# EAGLE design helen-art (EAGLE 7.7.0)
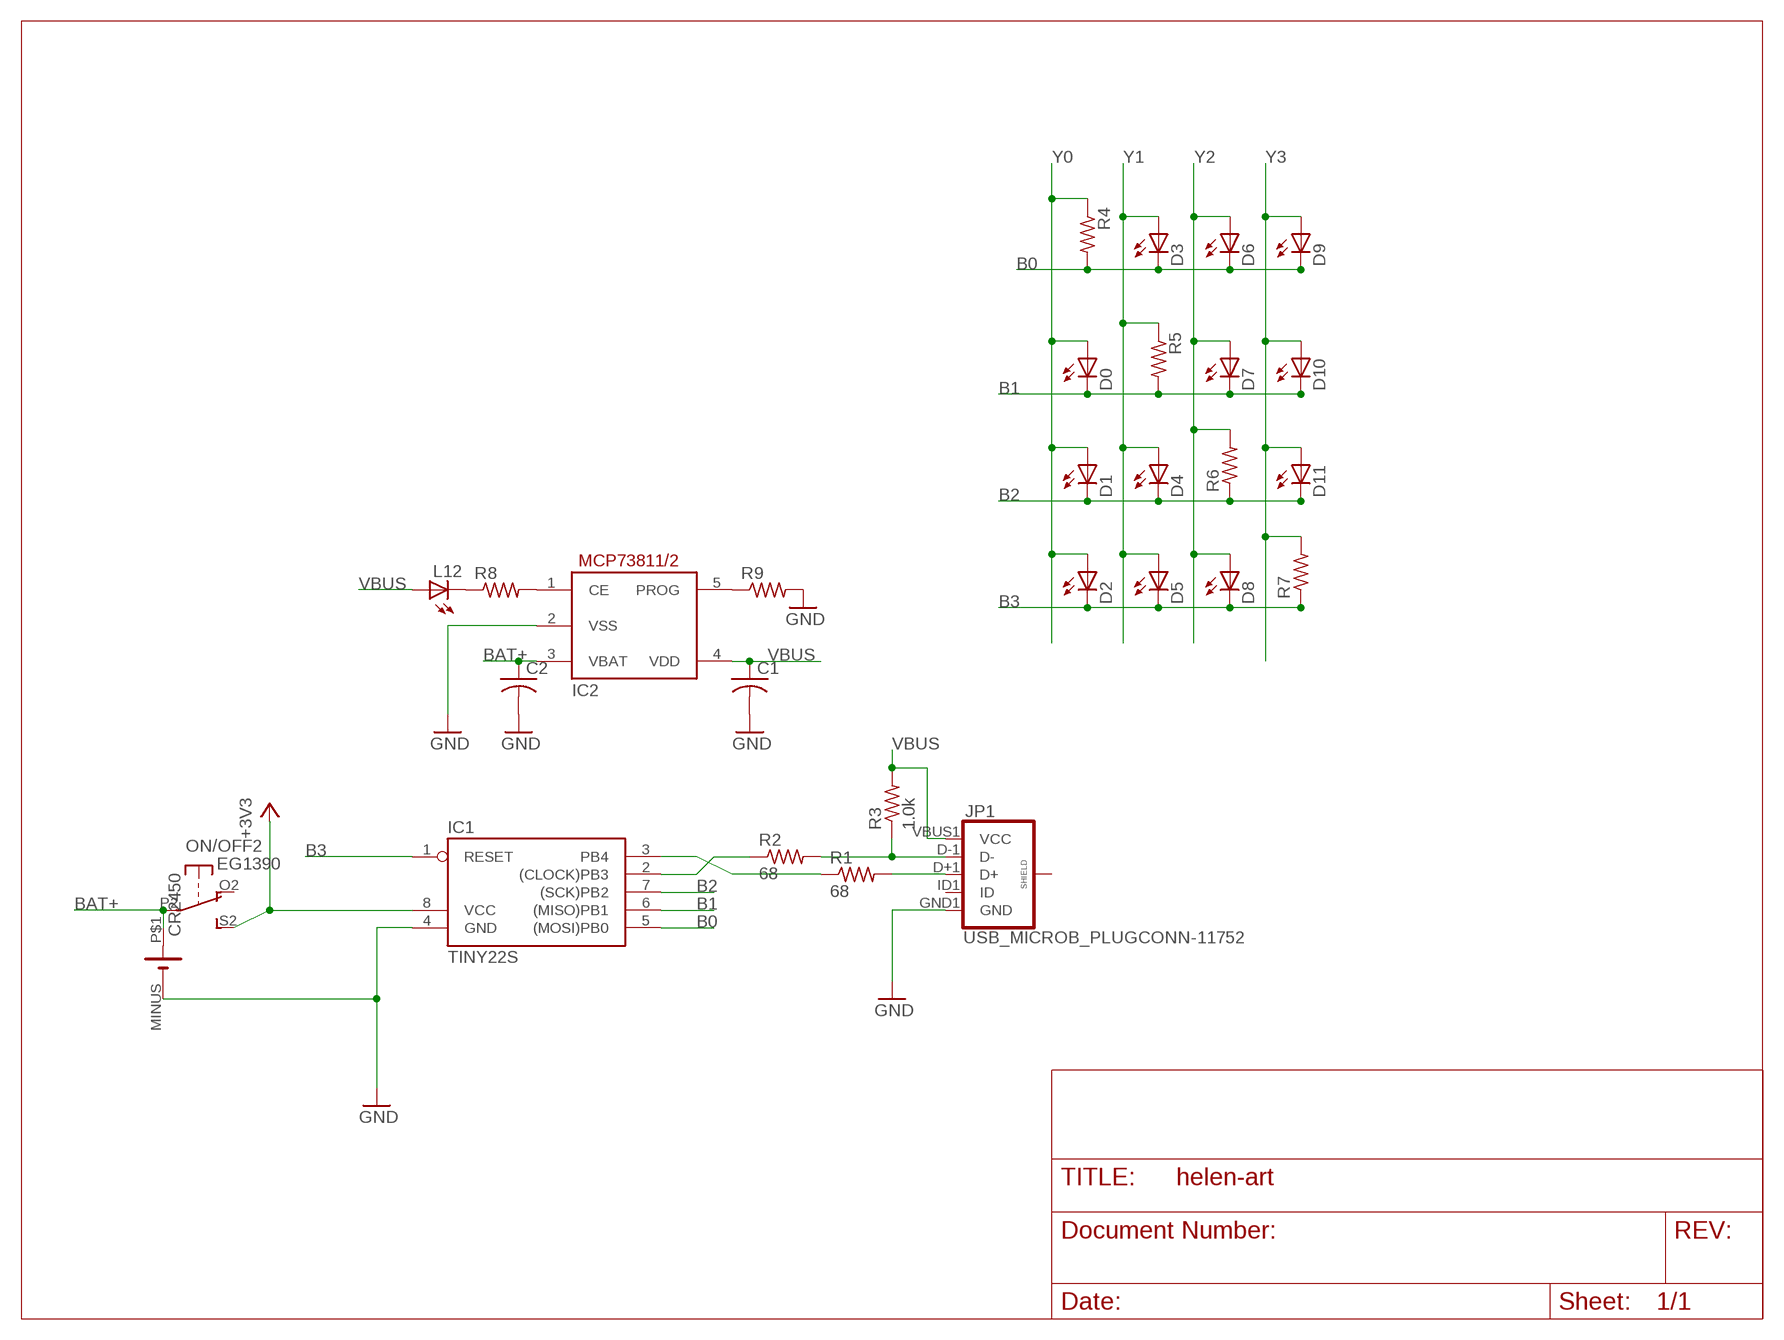
[diagram p0: schematic, sheet 1]

## Parts
C1  C-USC0603  [C0603]
C2  C-USC0603  [C0603]
D0  LEDCHIPLED_0805  [CHIPLED_0805]
D1  LEDCHIPLED_0805  [CHIPLED_0805]
D2  LEDCHIPLED_0805  [CHIPLED_0805]
D3  LEDCHIPLED_0805  [CHIPLED_0805]
D4  LEDCHIPLED_0805  [CHIPLED_0805]
D5  LEDCHIPLED_0805  [CHIPLED_0805]
D6  LEDCHIPLED_0805  [CHIPLED_0805]
D7  LEDCHIPLED_0805  [CHIPLED_0805]
D8  LEDCHIPLED_0805  [CHIPLED_0805]
D9  LEDCHIPLED_0805  [CHIPLED_0805]
D10  LEDCHIPLED_0805  [CHIPLED_0805]
D11  LEDCHIPLED_0805  [CHIPLED_0805]
IC1  TINY22S  [SOIC8]
IC2  MCP73811/2  [SOT23-5L]
JP1  USB_MICROB_PLUGCONN-11752  [USB-B-MICRO-SMD_V03]
L12  LEDCHIPLED_0805  [CHIPLED_0805]
ON/OFF  EG1390  DPDT-EG1390  [EG1390]
R1  68  R-US_R0603  [R0603]
R2  68  R-US_R0603  [R0603]
R3  1.0k  R-US_R0603  [R0603]
R4  R-US_R0603  [R0603]
R5  R-US_R0603  [R0603]
R6  R-US_R0603  [R0603]
R7  R-US_R0603  [R0603]
R8  R-US_R0603  [R0603]
R9  R-US_R0603  [R0603]
U$3  CR2450  CR2450_KEYSTONE  [CR2450_KEYSTONE]

## Nets
+3V3: IC1.8(VCC) ON/OFF.S2(2:S)
B0: D3.C D6.C D9.C IC1.5((MOSI)PB0) R4.2
B1: D0.C D7.C D10.C IC1.6((MISO)PB1) R5.2
B2: D1.C D4.C D11.C IC1.7((SCK)PB2) R6.1
B3: D2.C D5.C D8.C IC1.1(RESET) R7.1
BAT+: C2.1 IC2.3(VBAT) ON/OFF.P2(2:P) U$3.P$1(+)
GND: C1.2 C2.2 IC1.4(GND) IC2.2(VSS) JP1.GND1(GND) R9.2 U$3.MINUS(-)
N$1: JP1.D+1(D+) R1.2
N$2: JP1.D-1(D-) R2.2 R3.1
N$3: IC1.3(PB4) R1.1
N$4: IC1.2((CLOCK)PB3) R2.1
N$5: IC2.5(PROG) R9.1
N$6: IC2.1(CE) R8.2
N$7: L12.C R8.1
VBUS: C1.1 IC2.4(VDD) JP1.VBUS1(VCC) L12.A R3.2
Y0: D0.A D1.A D2.A R4.1
Y1: D3.A D4.A D5.A R5.1
Y2: D6.A D7.A D8.A R6.2
Y3: D9.A D10.A D11.A R7.2
Unconnected: JP1.ID1(ID) JP1.SHIELD1(SHIELD) JP1.SHIELD2(SHIELD) JP1.SHIELD3(SHIELD) ON/OFF.O1(1:O) ON/OFF.O2(2:O) ON/OFF.P1(1:P) ON/OFF.S1(1:S)

## Library data of the parts
C1 C2 = adafruit:C-US: CAPACITOR, American symbol
D0 D1-D11 L12 = led:LED: LED OSRAM: - CHIPLED LG R971, LG N971, LY N971, LG Q971, LY Q971, LO R971, LY R971 LH N974, LH R974 LS Q976, LO Q976, LY Q976 LO Q996 - Hyper CHIPLED LW Q18S LB Q993, LB Q99A, LB R99A - SideLED LS A670, LO A670, LY A670, LG A670, LP A670 LB A673, LV A673, LT A673, LW A673 LH A674 LY A675 LS A676, LA A676, LO A676, LY A676, LW A676 LS A679, LY A679, LG A679 - Hyper Micro SIDELED® LS Y876, LA Y876, LO Y876, LY Y876 LT Y87S - SmartLED LW L88C, LW L88S LB L89C, LB L89S, LG L890 LS L89K, LO L89K, LY L89K LS L896, LA L896, LO L896, LY L896 - TOPLED LS T670, LO T670, LY T670, LG T670, LP T670 LSG T670, LSP T670, LSY T670, LOP T670, LYG T670 LG T671, LOG T671, LSG T671 LB T673, LV T673, LT T673, LW T673 LH T674 LS T676, LA T676, LO T676, LY T676, LB T676, LH T676, LSB T676, LW T676 LB T67C, LV T67C, LT T67C, LS T67K, LO T67K, LY T67K, LW E67C LS E67B, LA E67B, LO E67B, LY E67B, LB E67C, LV E67C, LT E67C LW T67C LS T679, LY T679, LG T679 LS T770, LO T770, LY T770, LG T770, LP T770 LB T773, LV T773, LT T773, LW T773 LH T774 LS E675, LA E675, LY E675, LS T675 LS T776, LA T776, LO T776, LY T776, LB T776 LHGB T686 LT T68C, LB T68C - Hyper Mini TOPLED® LB M676 - Mini TOPLED Santana® LG M470 LS M47K, LO M47K, LY M47K Source: http://www.osram.convergy.de LUXEON: - LUMILED® LXK2-PW12-R00, LXK2-PW12-S00, LXK2-PW14-U00, LXK2-PW14-V00 LXK2-PM12-R00, LXK2-PM12-S00, LXK2-PM14-U00 LXK2-PE12-Q00, LXK2-PE12-R00, LXK2-PE12-S00, LXK2-PE14-T00, LXK2-PE14-U00 LXK2-PB12-K00, LXK2-PB12-L00, LXK2-PB12-M00, LXK2-PB14-N00, LXK2-PB14-P00, LXK2-PB14-Q00 LXK2-PR12-L00, LXK2-PR12-M00, LXK2-PR14-Q00, LXK2-PR14-R00 LXK2-PD12-Q00, LXK2-PD12-R00, LXK2-PD12-S00 LXK2-PH12-R00, LXK2-PH12-S00 LXK2-PL12-P00, LXK2-PL12-Q00, LXK2-PL12-R00 Source: www.luxeon.com KINGBRIGHT: KA-3528ASYC Source: www.kingbright.com
IC1 = atmel:TINY22: MICROCONTROLLER 1K ROM 128 bytes RAM 128 bytes EEPROM; OC_FARNELL: unknown; OC_NEWARK: unknown
IC2 = adafruit:MCP73811/2: MCP73811 and MCP73812 Simple, Miniature Single-Cell, Fully Integrated Li-Ion / Li-Polymer Charge Management Controllers SOT-23-5 package, no indicator LED but with adjustable current, small and very inexpensive
JP1 = SparkFun-Connectors:USB_MICROB_PLUG: USB Micro-B connectors Some male, some female. Watch your step!; PROD_ID: CONN-11752
ON/OFF = adafruit:DPDT
R1-R9 = resistor:R-US_: RESISTOR, American symbol
U$3 = _custom:CR2450_KEYSTONE

## Board
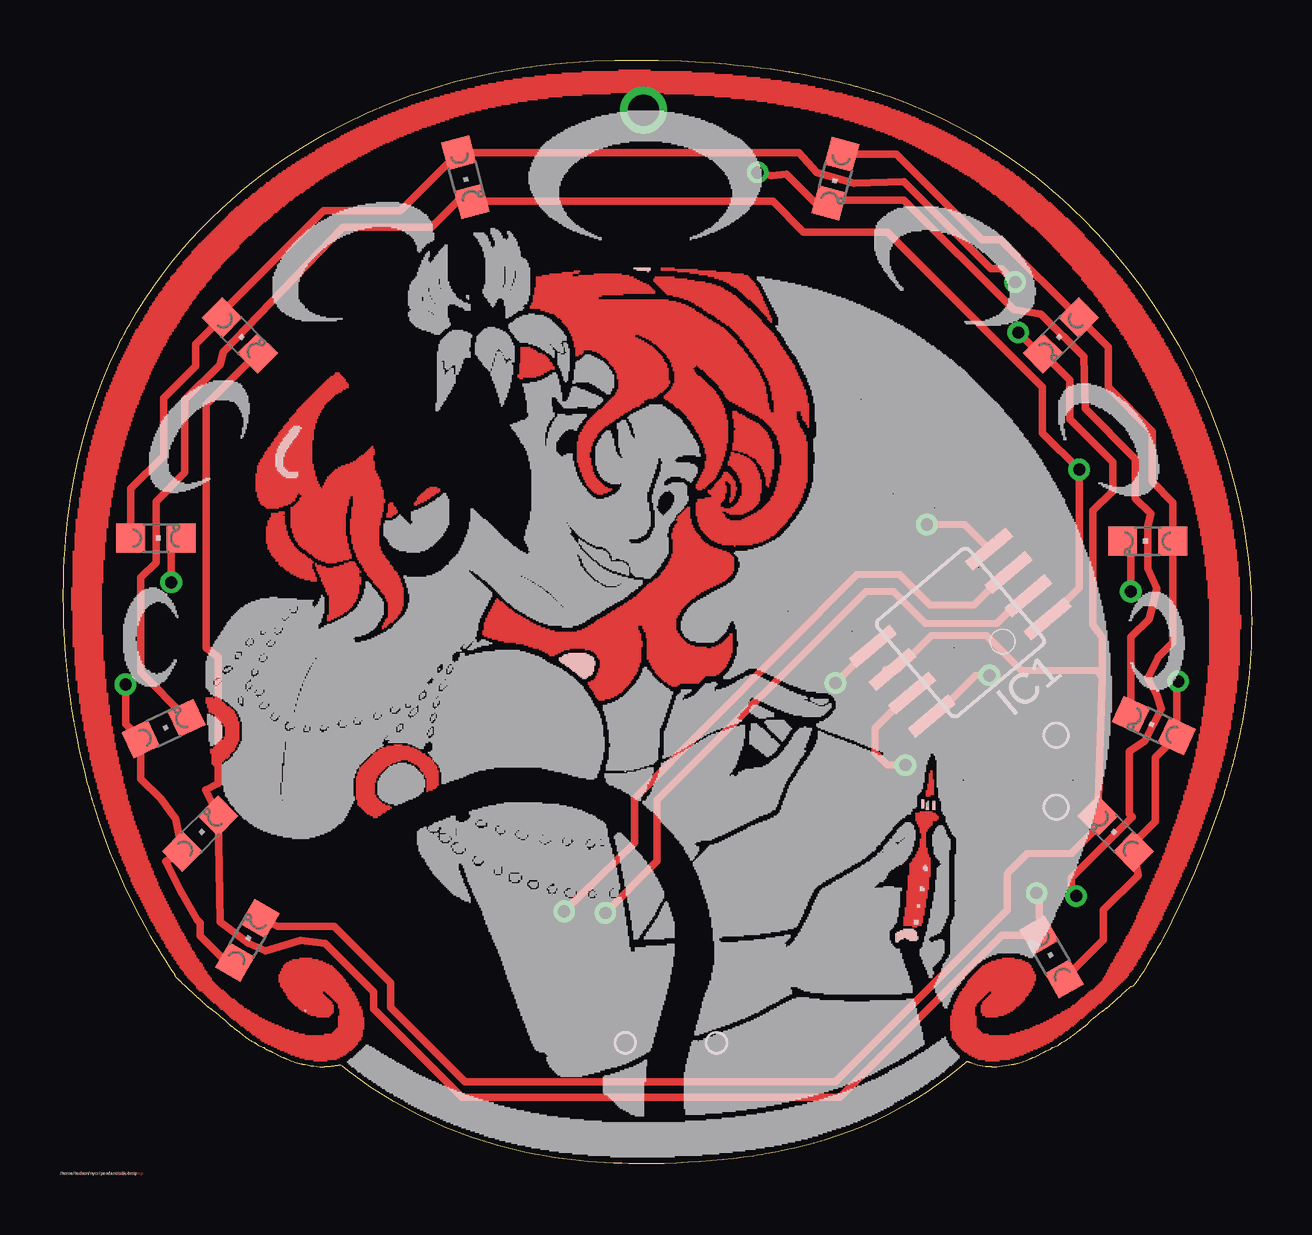
[diagram p1: board, top side]
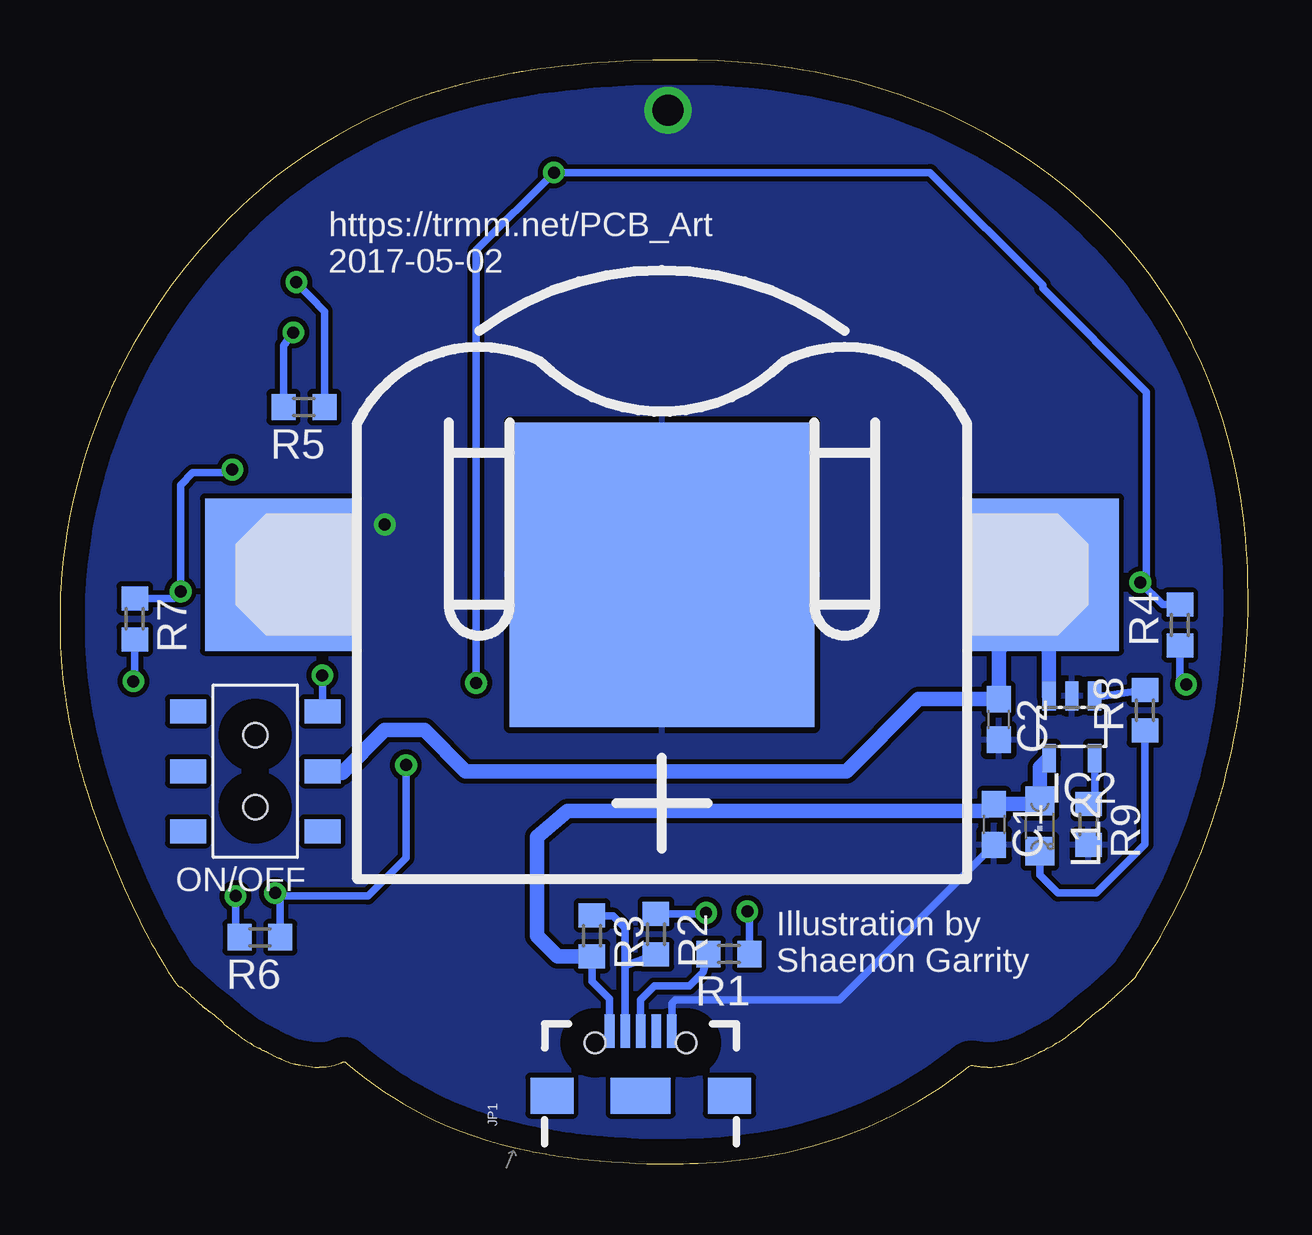
[diagram p2: board, bottom side, seen from below]

Size 49.53 x 46.02 mm. Coordinates in mm from the lower left corner, seen from the top.
Outline: 23.29,0.02 23.56,0.01 23.8,0 24.01,0 24.2,0 24.39,0 24.59,0 24.81,0.01 25.05,0.01 25.55,0.03 26.04,0.06 26.54,0.09 27.02,0.13 27.49,0.17 27.94,0.22 28.36,0.27 28.74,0.33 28.94,0.36 29.11,0.39 29.27,0.41 29.41,0.44 29.54,0.46 29.67,0.49 29.81,0.51 29.96,0.54 30.56,0.67 31.15,0.82 31.72,0.98 32.27,1.16 32.81,1.36 33.34,1.57 33.86,1.8 34.37,2.05 34.79,2.28 35.2,2.51 35.61,2.76 36.01,3.01 36.39,3.27 36.77,3.54 37.12,3.82 37.46,4.09 37.5,4.12 37.53,4.15 37.56,4.18 37.59,4.2 37.62,4.22 37.64,4.24 37.65,4.25 37.66,4.26 37.67,4.26 37.68,4.26 37.69,4.25 37.72,4.25 37.74,4.24 37.77,4.23 37.79,4.22 37.82,4.2 37.9,4.17 37.99,4.14 38.09,4.11 38.2,4.09 38.31,4.07 38.43,4.06 38.55,4.04 38.66,4.04 38.69,4.04 38.71,4.04 38.73,4.04 38.75,4.03 38.76,4.03 38.78,4.03 38.79,4.03 38.79,4.03 38.83,4.02 38.91,4.03 39.02,4.04 39.14,4.06 39.28,4.08 39.4,4.1 39.52,4.12 39.6,4.14 39.61,4.14 39.63,4.15 39.65,4.15 39.66,4.15 39.68,4.16 39.69,4.16 39.7,4.16 39.7,4.16 39.73,4.16 39.78,4.17 39.85,4.19 39.92,4.22 40.01,4.25 40.09,4.28 40.18,4.32 40.26,4.36 40.28,4.37 40.3,4.38 40.32,4.38 40.34,4.39 40.36,4.4 40.38,4.41 40.39,4.41 40.4,4.42 40.44,4.43 40.49,4.45 40.55,4.48 40.62,4.51 40.68,4.55 40.75,4.58 40.81,4.61 40.85,4.64 40.87,4.65 40.89,4.66 40.9,4.67 40.92,4.68 40.93,4.69 40.95,4.69 40.95,4.69 40.96,4.7 40.98,4.7 41.01,4.71 41.05,4.73 41.08,4.74 41.12,4.76 41.14,4.78 41.17,4.79 41.18,4.81 41.18,4.81 41.18,4.82 41.19,4.82 41.2,4.83 41.2,4.83 41.21,4.83 41.22,4.83 41.23,4.83 41.26,4.84 41.3,4.85 41.35,4.88 41.4,4.9 41.45,4.93 41.49,4.96 41.52,4.98 41.53,4.99 41.53,5 41.54,5 41.55,5.01 41.56,5.01 41.57,5.02 41.58,5.03 41.6,5.04 41.61,5.05 41.66,5.07 41.71,5.1 41.76,5.12 41.81,5.15 41.86,5.18 41.9,5.21 41.93,5.23 41.94,5.24 41.96,5.26 42,5.3 42.06,5.35 42.13,5.4 42.2,5.45 42.26,5.5 42.3,5.53 42.33,5.55 42.34,5.55 42.34,5.56 42.35,5.56 42.37,5.57 42.38,5.58 42.39,5.59 42.4,5.6 42.42,5.61 42.46,5.64 42.49,5.67 42.52,5.69 42.54,5.71 42.55,5.72 42.56,5.72 42.57,5.73 42.57,5.73 42.58,5.73 42.58,5.73 42.59,5.74 42.61,5.75 42.62,5.77 42.64,5.78 42.66,5.8 42.68,5.82 42.75,5.89 42.84,5.97 42.93,6.06 43.02,6.14 43.11,6.21 43.19,6.27 43.24,6.32 43.28,6.35 43.29,6.35 43.31,6.36 43.32,6.37 43.33,6.38 43.35,6.39 43.36,6.4 43.37,6.41 43.38,6.42 43.39,6.43 43.4,6.44 43.42,6.45 43.43,6.46 43.45,6.47 43.46,6.48 43.47,6.48 43.49,6.49 43.5,6.5 43.51,6.51 43.53,6.52 43.54,6.53 43.56,6.54 43.57,6.55 43.58,6.56 43.59,6.58 43.61,6.59 43.62,6.61 43.64,6.63 43.67,6.65 43.69,6.67 43.72,6.7 43.75,6.72 43.78,6.75 43.81,6.77 43.84,6.8 43.87,6.83 43.91,6.86 43.94,6.89 43.97,6.92 44,6.95 44.03,6.97 44.15,7.09 44.25,7.18 44.33,7.25 44.39,7.3 44.43,7.34 44.46,7.36 44.48,7.38 44.49,7.38 44.53,7.38 44.58,7.4 44.62,7.45 44.69,7.52 44.77,7.64 44.87,7.8 45.01,8.01 45.18,8.29 45.34,8.55 45.47,8.78 45.6,8.99 45.72,9.2 45.83,9.41 45.95,9.63 46.07,9.87 46.2,10.14 46.52,10.78 46.83,11.45 47.13,12.14 47.42,12.84 47.7,13.53 47.95,14.2 48.18,14.85 48.38,15.45 48.4,15.51 48.42,15.57 48.43,15.62 48.45,15.68 48.46,15.72 48.48,15.76 48.48,15.78 48.49,15.8 48.5,15.84 48.52,15.89 48.54,15.95 48.56,16.02 48.58,16.1 48.6,16.19 48.63,16.28 48.65,16.37 48.66,16.41 48.67,16.44 48.68,16.48 48.69,16.52 48.7,16.55 48.71,16.57 48.72,16.59 48.72,16.61 48.73,16.62 48.73,16.65 48.74,16.69 48.76,16.74 48.77,16.79 48.79,16.85 48.8,16.92 48.82,16.99 48.83,17.06 48.85,17.13 48.87,17.21 48.89,17.29 48.91,17.36 48.93,17.43 48.94,17.5 48.95,17.55 48.99,17.72 49.04,17.92 49.08,18.15 49.13,18.4 49.18,18.66 49.22,18.91 49.26,19.15 49.29,19.36 49.33,19.6 49.36,19.82 49.38,20.03 49.41,20.24 49.43,20.47 49.45,20.71 49.48,20.99 49.5,21.32 49.51,21.53 49.52,21.84 49.53,22.22 49.53,22.63 49.52,23.04 49.52,23.43 49.51,23.76 49.5,23.99 49.45,24.62 49.39,25.23 49.31,25.83 49.22,26.42 49.11,27 48.99,27.59 48.85,28.19 48.69,28.8 48.58,29.19 48.45,29.61 48.3,30.05 48.14,30.5 47.98,30.94 47.81,31.37 47.64,31.78 47.48,32.14 47.46,32.2 47.43,32.26 47.39,32.33 47.36,32.4 47.33,32.47 47.3,32.53 47.28,32.59 47.25,32.64 47.23,32.69 47.2,32.76 47.16,32.84 47.12,32.92 47.07,33.01 47.03,33.11 46.98,33.2 46.93,33.29 46.47,34.15 45.98,34.99 45.46,35.8 44.91,36.58 44.33,37.34 43.72,38.08 43.09,38.78 42.42,39.47 42.17,39.72 41.93,39.94 41.7,40.16 41.48,40.36 41.25,40.56 41.02,40.75 40.77,40.95 40.51,41.16 39.92,41.61 39.29,42.05 38.65,42.47 37.98,42.87 37.31,43.24 36.62,43.59 35.93,43.91 35.24,44.19 35.09,44.25 34.93,44.31 34.76,44.37 34.59,44.44 34.42,44.49 34.27,44.55 34.14,44.59 34.05,44.62 34.02,44.63 33.98,44.64 33.94,44.66 33.89,44.67 33.83,44.69 33.78,44.71 33.73,44.72 33.67,44.74 33.62,44.76 33.55,44.78 33.48,44.8 33.41,44.82 33.33,44.84 33.26,44.86 33.19,44.88 33.13,44.9 33.07,44.91 33.01,44.93 32.95,44.95 32.89,44.96 32.84,44.98 32.8,44.99 32.76,45 32.74,45 32.56,45.05 32.33,45.11 32.05,45.17 31.75,45.24 31.44,45.3 31.14,45.36 30.86,45.42 30.63,45.46 30.58,45.47 30.52,45.48 30.47,45.49 30.41,45.5 30.36,45.51 30.31,45.52 30.27,45.52 30.23,45.53 29.89,45.59 29.49,45.64 29.06,45.7 28.59,45.75 28.1,45.8 27.61,45.85 27.12,45.89 26.65,45.93 25.74,45.98 24.81,46.01 23.89,46.02 22.98,46 22.1,45.97 21.26,45.93 20.46,45.86 19.73,45.77 19.5,45.74 19.32,45.71 19.16,45.69 19.02,45.67 18.91,45.65 18.79,45.64 18.68,45.62 18.56,45.6 18.29,45.55 18.01,45.5 17.74,45.44 17.46,45.39 17.18,45.32 16.9,45.26 16.62,45.19 16.35,45.12 15.4,44.85 14.47,44.54 13.55,44.19 12.65,43.81 11.77,43.39 10.91,42.93 10.07,42.44 9.25,41.92 8.77,41.59 8.31,41.25 7.87,40.91 7.44,40.56 7.02,40.2 6.59,39.81 6.16,39.4 5.73,38.96 5.31,38.52 4.9,38.06 4.5,37.57 4.11,37.07 3.74,36.55 3.39,36.03 3.06,35.51 2.76,34.99 2.67,34.83 2.6,34.7 2.54,34.6 2.49,34.51 2.45,34.42 2.4,34.33 2.35,34.23 2.28,34.1 1.94,33.37 1.62,32.61 1.33,31.83 1.06,31.03 0.82,30.21 0.62,29.39 0.44,28.58 0.31,27.77 0.24,27.31 0.19,26.87 0.14,26.45 0.1,26.04 0.07,25.63 0.04,25.21 0.02,24.76 0.01,24.28 0,23.69 0,23.08 0.02,22.46 0.05,21.82 0.1,21.19 0.15,20.56 0.22,19.95 0.3,19.36 0.33,19.17 0.35,19.01 0.37,18.88 0.39,18.77 0.4,18.68 0.42,18.61 0.43,18.55 0.43,18.51 0.44,18.49 0.44,18.46 0.45,18.43 0.46,18.4 0.46,18.36 0.47,18.32 0.48,18.28 0.48,18.24 0.53,17.99 0.59,17.68 0.67,17.32 0.75,16.94 0.84,16.56 0.92,16.21 1,15.91 1.07,15.68 1.07,15.65 1.08,15.63 1.09,15.6 1.1,15.57 1.11,15.53 1.12,15.5 1.13,15.47 1.14,15.43 1.14,15.4 1.15,15.37 1.16,15.34 1.17,15.31 1.18,15.28 1.18,15.26 1.19,15.24 1.19,15.23 1.2,15.22 1.21,15.2 1.21,15.17 1.22,15.14 1.23,15.11 1.24,15.08 1.25,15.04 1.26,15.01 1.47,14.34 1.7,13.67 1.96,12.99 2.24,12.31 2.54,11.64 2.85,10.98 3.17,10.34 3.51,9.73 3.64,9.49 3.79,9.24 3.95,8.98 4.11,8.73 4.26,8.49 4.39,8.28 4.5,8.11 4.59,7.99 4.6,7.98 4.61,7.96 4.62,7.94 4.63,7.92 4.64,7.9 4.65,7.88 4.66,7.86 4.67,7.84 4.68,7.82 4.69,7.8 4.7,7.79 4.71,7.77 4.72,7.75 4.74,7.74 4.75,7.73 4.76,7.72 4.77,7.71 4.78,7.7 4.8,7.68 4.81,7.67 4.83,7.66 4.85,7.64 4.86,7.63 4.87,7.61 4.9,7.59 4.92,7.56 4.96,7.53 5,7.49 5.05,7.44 5.12,7.38 5.2,7.3 5.29,7.22 5.32,7.19 5.36,7.15 5.4,7.12 5.43,7.09 5.47,7.06 5.5,7.03 5.53,7 5.56,6.97 5.58,6.95 5.61,6.92 5.65,6.89 5.68,6.86 5.71,6.83 5.75,6.8 5.78,6.77 5.81,6.75 5.84,6.72 5.86,6.7 5.89,6.67 5.92,6.65 5.94,6.63 5.96,6.61 5.98,6.59 5.99,6.58 6,6.56 6.02,6.55 6.03,6.54 6.04,6.53 6.06,6.52 6.07,6.51 6.09,6.5 6.1,6.49 6.11,6.48 6.12,6.48 6.14,6.47 6.15,6.46 6.17,6.45 6.18,6.44 6.19,6.43 6.2,6.42 6.21,6.41 6.23,6.4 6.24,6.39 6.25,6.38 6.27,6.37 6.28,6.36 6.29,6.35 6.3,6.35 6.34,6.32 6.4,6.27 6.48,6.21 6.56,6.14 6.66,6.06 6.75,5.97 6.83,5.89 6.91,5.82 6.93,5.8 6.95,5.78 6.96,5.77 6.98,5.75 6.99,5.74 7,5.73 7.01,5.73 7.01,5.73 7.02,5.73 7.02,5.72 7.03,5.72 7.05,5.71 7.07,5.69 7.09,5.67 7.13,5.64 7.17,5.61 7.18,5.6 7.19,5.59 7.21,5.58 7.22,5.57 7.23,5.56 7.24,5.56 7.25,5.55 7.26,5.55 7.28,5.53 7.33,5.5 7.39,5.45 7.46,5.4 7.52,5.35 7.58,5.3 7.62,5.26 7.65,5.24 7.66,5.23 7.69,5.21 7.73,5.18 7.77,5.15 7.83,5.12 7.88,5.1 7.93,5.07 7.97,5.05 7.99,5.04 8,5.03 8.02,5.02 8.03,5.01 8.04,5.01 8.05,5 8.05,5 8.05,4.99 8.06,4.98 8.09,4.96 8.14,4.93 8.18,4.9 8.24,4.88 8.28,4.85 8.32,4.84 8.35,4.83 8.36,4.83 8.37,4.83 8.38,4.83 8.39,4.83 8.4,4.82 8.4,4.82 8.41,4.81 8.41,4.81 8.42,4.79 8.44,4.78 8.47,4.76 8.5,4.74 8.54,4.73 8.57,4.71 8.6,4.7 8.62,4.7 8.63,4.69 8.64,4.69 8.65,4.69 8.67,4.68 8.68,4.67 8.7,4.66 8.72,4.65 8.73,4.64 8.78,4.61 8.84,4.58 8.9,4.54 8.97,4.51 9.03,4.48 9.09,4.45 9.14,4.43 9.18,4.42 9.19,4.41 9.21,4.41 9.22,4.4 9.24,4.39 9.26,4.38 9.28,4.38 9.31,4.37 9.33,4.36 9.41,4.32 9.49,4.28 9.58,4.25 9.66,4.22 9.74,4.19 9.8,4.17 9.85,4.16 9.88,4.16 9.89,4.16 9.9,4.16 9.91,4.16 9.92,4.15 9.94,4.15 9.95,4.15 9.97,4.14 9.99,4.14 10.07,4.12 10.18,4.1 10.31,4.08 10.44,4.06 10.57,4.04 10.68,4.03 10.76,4.03 10.8,4.03 10.81,4.03 10.82,4.03 10.84,4.03 10.87,4.04 10.9,4.04 10.93,4.04 10.96,4.04 11,4.04 11.04,4.05 11.09,4.05 11.13,4.06 11.18,4.06 11.23,4.07 11.28,4.07 11.33,4.08 11.37,4.09 11.4,4.09 11.42,4.09 11.45,4.1 11.47,4.1 11.49,4.11 11.52,4.11 11.54,4.11 11.57,4.12 11.6,4.09 11.64,4.06 11.68,4.03 11.72,4 11.75,3.97 11.79,3.94 11.83,3.92 11.86,3.89 12.81,3.2 13.79,2.58 14.82,2.02 15.89,1.53 17,1.11 18.13,0.75 19.3,0.47 20.49,0.26 20.83,0.21 21.18,0.17 21.53,0.13 21.88,0.1 22.23,0.07 22.58,0.05 22.94,0.03 23.29,0.02 23.29,0.02
Outline: 23.29,0.02 23.29,0.02
Outline: 23.29,0.02 23.29,0.02
Outline: 23.29,0.02 23.29,0.02
Outline: 23.29,0.02 23.29,0.02
Outline: 23.29,0.02 23.29,0.02
Copper layers (1*16): Top 0.035mm / dielectric 1.5mm / Bottom 0.035mm
Design rules "default": minimum track width 10mil, minimum drill 24mil, track to track 8mil, track to pad 8mil, pad to pad 8mil, via to via 8mil, smd to smd 8mil, copper to edge 40mil, drill to drill 8mil, minimum pad ring 10mil, minimum via ring 8mil, stop-mask expansion 4mil, vias tented up to drill 0mil, thermal gap 10mil

### Footprints (pad centres in the part's own frame; a part is rotated, then mirrored left to right if it is on the bottom)
C0603 = smd 1.1 x 1: 1 -0.85,0; 2 0.85,0
CHIPLED_0805 = smd 1.2 x 1.2: A 0,-1.05; C 0,1.05
SOIC8 = smd 0.5 x 2.2: 1 -1.905,-3.154; 2 -0.645,-3.154; 3 0.625,-3.154; 4 1.895,-3.154; 5 1.905,3.154; 6 0.635,3.154; 7 -0.635,3.154; 8 -1.905,3.154
SOT23-5L = smd 0.55 x 1.2: 1 -0.95,-1.3; 2 0,-1.3; 3 0.95,-1.3; 4 0.95,1.3; 5 -0.95,1.3
USB-B-MICRO-SMD_V03 = smd 1.4 x 0.4: D+1 2.7,0; D-1 2.7,0.65; GND1 2.7,-1.3; ID1 2.7,-0.65; VBUS1 2.7,1.3 | smd 1.5 x 1.8: SHIELD1 0,3.7; SHIELD2 0,-3.7 | smd 1.5 x 2.5: SHIELD3 0,0 | hole 0.85: 2.2,1.9; 2.2,-1.9
EG1390 = smd 1 x 1.5: O1 -2.5,2.8; O2 -2.5,-2.8; P1 0,2.8; P2 0,-2.8; S1 2.5,2.8; S2 2.5,-2.8 | hole 1: 1.5,0; -1.5,0
R0603 = smd 1 x 1.1: 1 -0.85,0; 2 0.85,0
CR2450_KEYSTONE = smd 12.7 x 12.7: MINUS 0,0 | smd 6.35 x 6.35: P$1 -15.875,0; P$2 15.875,0

### Placement (x,y rotation side)
C1  10.59,14.15 270 bottom
C2  10.4,18.53 270 bottom
D0  7.67,9.32 330 top
D1  5.7,13.77 315 top
D2  4.18,18.15 295 top
D3  3.86,26.08 270 top
D4  7.35,34.53 225 top
D5  16.75,41.13 195 top
D6  32.18,41.07 165 top
D7  41.58,34.53 135 top
D8  45.2,25.96 90 top
D9  45.45,18.27 65 top
D10  43.86,13.77 45 top
D11  41.2,8.62 30 top
IC1  37.39,22.15 130 top
IC2  7.35,18.21 180 bottom
JP1  25.32,2.84 90 bottom
L12  8.69,14.08 180 bottom
ON/OFF  41.39,16.37 90 bottom
R1  21.64,8.75 180 bottom
R2  24.69,9.57 270 bottom
R3  27.35,9.51 270 bottom
R4  2.84,22.46 90 bottom
R5  39.36,31.55 180 bottom
R6  41.2,9.45 180 bottom
R7  46.4,22.72 270 bottom
R8  4.3,18.91 90 bottom
R9  6.65,14.15 270 bottom
U$3  24.43,24.56 180 bottom

### Tracks (layer width: path | path; a pad name or v marks a point on that pad's centre or on a via)
+3V3  (via drill 0.5)
  Top 0.305: IC1.8 36.31,18.66 38.02,20.37 v38.59,20.37
  Bottom 0.305: ON/OFF.S2 v38.59,20.36 v38.59,20.37
B0  (via drill 0.5)
  Top 0.305: v4.49,24.24 4.49,25.67 D3.C | v28.94,41.32 29.51,41.2 30.15,41.26 31.35,40.06 D6.C 32.03,40.18 35.04,40.18 39.61,35.61 40.75,35.42 42.53,33.64 42.59,31.48 44.69,29.39 44.69,27.74 45.32,27.1 45.2,26.59 45.2,24.81 45.58,23.99 45.26,22.72 44.5,21.96 D9.C | IC1.5 33.71,21.58 v32.18,20.05
  Bottom 0.305: R4.2 3.57,23.31 v4.49,24.24 4.24,24.5 4.24,32.18 8.56,36.5 8.56,36.63 13.26,41.32 v28.94,41.32 32.18,38.09 v32.18,20.05
B1  (via drill 0.5)
  Top 0.305: 43.31,20.31 43.31,21.94 42.91,22.46 42.91,27.23 43.74,28.05 43.74,29.26 41.96,31.04 41.96,32.66 D7.C 40.67,33.79 v39.8,34.66 | 43.31,20.31 D10.C | D0.C 8.94,9.89 11.29,9.89 13.64,7.54 13.64,6.53 16.75,3.41 32.18,3.41 39.36,10.59 39.36,12.11 40.18,12.94 42.02,12.94 43.12,14.04 D10.C | 43.02,14.25 D10.C | 34.26,20.61 IC1.6 34.77,20.61 36.18,22.02 38.47,22.02 39.93,20.56 43.06,20.56 43.31,20.31
  Bottom 0.305: R5.2 40.21,34.11 v39.8,34.66
B2  (via drill 0.5)
  Top 0.305: D4.C 5.95,31.65 5.95,21.51 6.46,21.13 6.46,15.86 5.93,15.59 D1.C 6.46,14.51 6.53,10.08 7.73,9.19 8.43,8.88 9.89,9.32 10.91,9.19 12.94,7.16 12.94,6.46 16.62,2.78 32.37,2.78 39.12,9.53 D11.C 40.67,11.18 v40.56,11.29 | IC1.7 35.19,19.63 35.19,19.51 33.83,18.15 33.83,17.13 34.34,16.62 v35.1,16.62
  Bottom 0.305: R6.1 40.35,11.07 v40.56,11.29 40.44,11.16 36.69,11.16 35.1,12.75 v35.1,16.62
B3  (via drill 0.5)
  Top 0.305: IC1.1 42.34,24.03 v42.34,28.94 40.82,30.47 40.82,32.37 34.34,38.85 30.85,38.85 29.57,40.12 D5.C 16.43,40.12 15.35,39.04 11.67,39.04 6.65,33.83 6.53,33.32 5.07,31.86 5.07,28.81 3.86,27.61 3.86,25.07 3.22,24.43 3.22,20.49 D2.C | D8.C 44.5,25.61 v44.5,23.86
  Bottom 0.305: v42.34,28.94 42.47,28.81 43.99,28.81 44.5,28.31 v44.5,23.86 44.79,23.57 R7.1
BAT+
  Bottom 0.61: IC2.3 8.3,23.54 | 8.3,23.54 8.3,24.3 U$3.P$1 | 8.3,23.54 10.4,21.45 C2.1 13.74,19.38 16.75,16.37 32.62,16.37 34.34,18.08 35.99,18.08 37.77,16.31 38.52,16.31 ON/OFF.P2
GND  (via drill 0.5, 1.3)
  Top 0.305: IC1.4 37.56,26.66 v35.99,26.66
  Bottom 0.305: JP1.GND1 24.02,6.68 23.86,6.84 17.04,6.84 C1.2
  other vias: 24.18,43.93
  pour Bottom: -0.4,46.59 49.96,46.59 49.96,-0.4 -0.46,-0.4 -0.46,46.59
N$1
  Bottom 0.305: JP1.D+1 25.32,6.84 24.75,7.41 23.29,7.41 22.72,7.99 R1.2
N$2
  Bottom 0.305: JP1.D-1 25.97,8.26 | 25.97,8.26 R2.2 | 25.97,8.26 25.97,9.84 26.47,10.34 27.33,10.34 R3.1
N$3  (via drill 0.5)
  Top 0.305: IC1.3 39.32,24.65 37.96,23.29 36.12,23.29 34.85,24.56 33.07,24.56 23.8,15.23 23.8,13.38 v20.88,10.53
  Bottom 0.305: R1.1 20.79,10.44 v20.88,10.53
N$4  (via drill 0.5)
  Top 0.305: IC1.2 40.06,23.68 38.91,22.53 35.93,22.53 34.59,23.86 33.45,23.86 24.75,15.16 24.75,12.62 v22.59,10.46
  Bottom 0.305: R2.1 22.63,10.42 v22.59,10.46
N$5
  Bottom 0.305: IC2.5 6.4,15.25 R9.1
N$6
  Bottom 0.305: IC2.1 6.01,19.51 R8.2
N$7
  Bottom 0.305: R8.1 4.3,13.32 6.34,11.29 7.92,11.29 8.68,12.05 L12.C
VBUS
  Bottom 0.305: JP1.VBUS1 26.62,6.87 27.35,7.61 R3.2
  Bottom 0.61: R3.2 28.79,8.66 29.64,9.51 29.64,13.64 28.37,14.72 10.87,14.72 C1.1 8.82,15 L12.A 8.68,16.53 IC2.4
Y0  (via drill 0.5)
  Top 0.305: D0.A 7.24,7.97 5.7,9.51 5.7,10.04 5.57,10.17 4.94,11.29 4.26,12.6 D1.A 4.68,14.38 4.05,15.23 3.22,16.05 D2.A 2.59,18.34 v2.59,19.99
  Bottom 0.305: R4.1 2.84,20.24 v2.59,19.99
Y1  (via drill 0.5)
  Top 0.305: D3.A 2.81,28.15 4.18,29.51 4.18,31.93 5.51,33.26 5.51,34.17 D4.A 6.61,35.5 10.84,39.74 14.07,39.74 D5.A 30.66,42.15 31.42,41.32 32.94,40.88 35.04,40.94 38.66,37.32 39.1,37.32 v39.67,36.75
  Bottom 0.305: R5.1 38.51,35.52 v39.67,36.75
Y2  (via drill 0.5)
  Top 0.305: D6.A 34.72,42.08 38.28,38.53 39.06,38.53 D7.A 43.55,34.05 43.55,32.37 45.39,30.53 45.39,28.43 46.25,27.57 D8.A 46.25,21.74 45.64,21.13 45.2,20.24 45.58,19.54 45.77,18.97 45.07,17.64 44.44,17.19 44.44,14.59 44.56,14.46 42.02,11.92 42.02,11.35 v42.21,11.16
  Bottom 0.305: R6.2 42.21,9.8 v42.21,11.16
Y3  (via drill 0.5)
  Top 0.305: D11.A 43.36,9.35 43.36,10.59 44.8,12.03 D10.A 44.61,13.36 45.52,14.27 45.52,16.94 D9.A 46.4,20.05 v46.47,20.11
  Bottom 0.305: R7.2 46.4,20.18 v46.47,20.11
(copper drawn outside any net)
  shapes: Top area x2903

### Text on the board
Top: /home/hudson/nycr/pendant/copper.bmp
tPlace: /home/hudson/nycr/pendant/silk.bmp
bNames: https://trmm.net/PCB_Art / 2017-05-02 | Illustration by / Shaenon Garrity
tStop: /home/hudson/nycr/pendant/mask.bmp